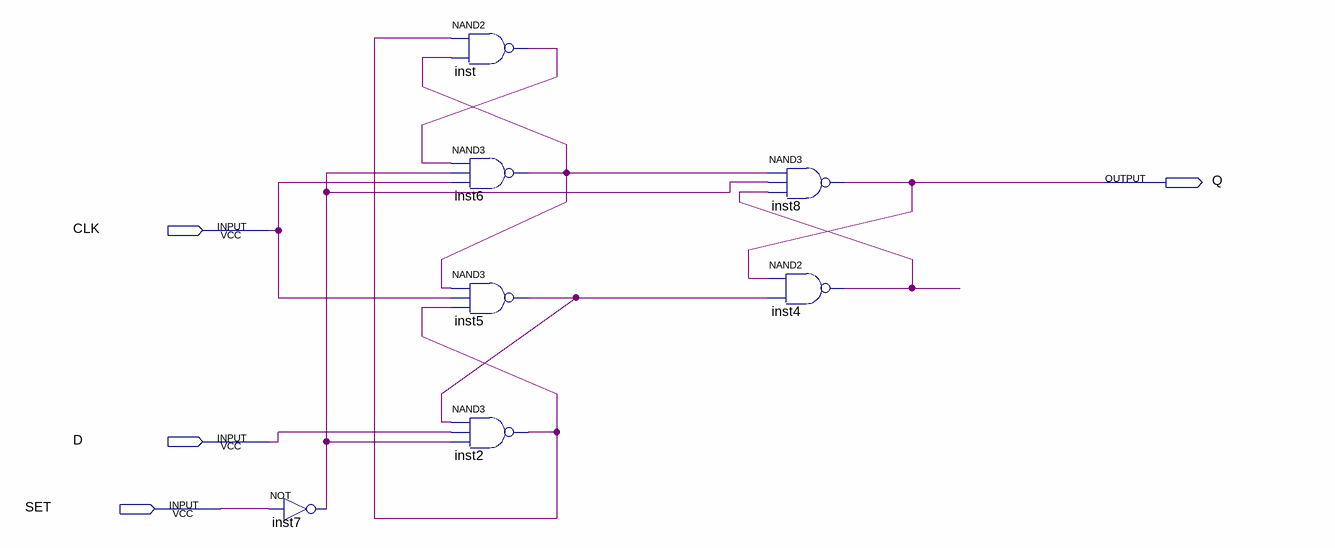
[diagram p0: schematic sheet]
// Quartus schematic DFFwithSET.bdf as structural Verilog: 7 symbols, 4 pins
module DFFwithSET (
  input  CLK,
  input  D,
  input  SET,
  output Q
);

  wire inst2_out, inst4_out, inst5_out, inst6_out, inst7_out, inst_out;

  not inst7 (inst7_out, SET);
  nand inst (inst_out, inst2_out, inst6_out);
  nand inst6 (inst6_out, inst_out, inst7_out, CLK);
  nand inst5 (inst5_out, inst6_out, CLK, inst2_out);
  nand inst2 (inst2_out, inst5_out, D, inst7_out);
  nand inst8 (Q, inst6_out, inst7_out, inst4_out);
  nand inst4 (inst4_out, Q, inst5_out);
endmodule
